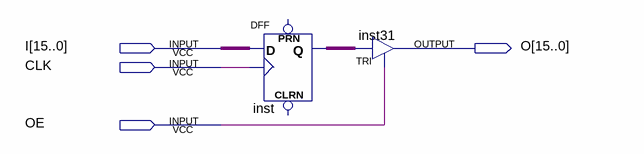
[diagram p0: schematic sheet]
// Quartus schematic RE16bit.bdf as structural Verilog: 2 symbols, 4 pins
module RE16bit (
  input  [15:0] I,
  input  CLK,
  input  OE,
  output [15:0] O
);

  wire [15:0] inst_q;

  DFF inst[15:0] (.CLK(CLK), .D(I), .Q(inst_q));  // open: CLRN, PRN
  TRI inst31[15:0] (.IN(inst_q), .OE(OE), .OUT(O));
endmodule
